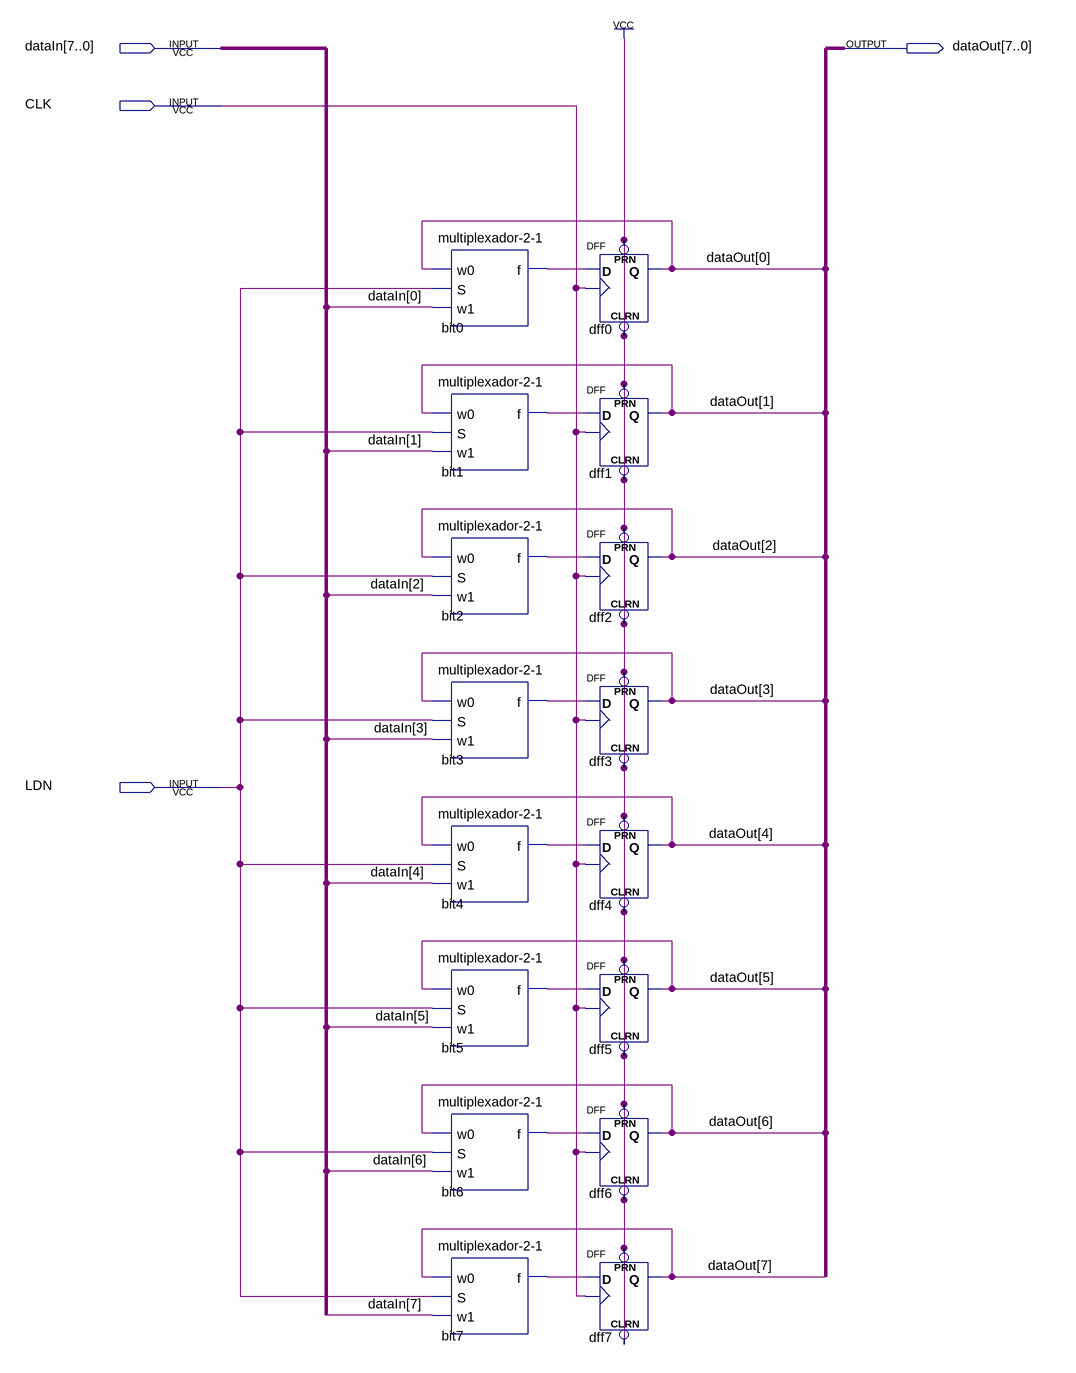
[diagram p0: schematic sheet]
// Quartus schematic registrador.bdf as structural Verilog: 16 symbols, 4 pins
module registrador (
  input  [7:0] dataIn,
  input  CLK,
  input  LDN,
  output [7:0] dataOut
);

  wire bit0_f, bit1_f, bit2_f, bit3_f, bit4_f, bit5_f, bit6_f, bit7_f;

  \multiplexador-2-1  bit0 (.w0(dataOut[0]), .S(LDN), .w1(dataIn[0]), .f(bit0_f));
  \multiplexador-2-1  bit1 (.w0(dataOut[1]), .S(LDN), .w1(dataIn[1]), .f(bit1_f));
  \multiplexador-2-1  bit2 (.w0(dataOut[2]), .S(LDN), .w1(dataIn[2]), .f(bit2_f));
  \multiplexador-2-1  bit3 (.w0(dataOut[3]), .S(LDN), .w1(dataIn[3]), .f(bit3_f));
  \multiplexador-2-1  bit4 (.w0(dataOut[4]), .S(LDN), .w1(dataIn[4]), .f(bit4_f));
  \multiplexador-2-1  bit5 (.w0(dataOut[5]), .S(LDN), .w1(dataIn[5]), .f(bit5_f));
  \multiplexador-2-1  bit6 (.w0(dataOut[6]), .S(LDN), .w1(dataIn[6]), .f(bit6_f));
  \multiplexador-2-1  bit7 (.w0(dataOut[7]), .S(LDN), .w1(dataIn[7]), .f(bit7_f));
  DFF dff0 (.CLRN(1'b1), .CLK(CLK), .D(bit0_f), .PRN(1'b1), .Q(dataOut[0]));
  DFF dff1 (.CLRN(1'b1), .CLK(CLK), .D(bit1_f), .PRN(1'b1), .Q(dataOut[1]));
  DFF dff2 (.CLRN(1'b1), .CLK(CLK), .D(bit2_f), .PRN(1'b1), .Q(dataOut[2]));
  DFF dff3 (.CLRN(1'b1), .CLK(CLK), .D(bit3_f), .PRN(1'b1), .Q(dataOut[3]));
  DFF dff4 (.CLRN(1'b1), .CLK(CLK), .D(bit4_f), .PRN(1'b1), .Q(dataOut[4]));
  DFF dff5 (.CLRN(1'b1), .CLK(CLK), .D(bit5_f), .PRN(1'b1), .Q(dataOut[5]));
  DFF dff6 (.CLRN(1'b1), .CLK(CLK), .D(bit6_f), .PRN(1'b1), .Q(dataOut[6]));
  DFF dff7 (.CLRN(1'b1), .CLK(CLK), .D(bit7_f), .PRN(1'b1), .Q(dataOut[7]));
endmodule
